# Altium schematic sheet JTAG&Trace.SchDoc
size A4; Revision: C.2
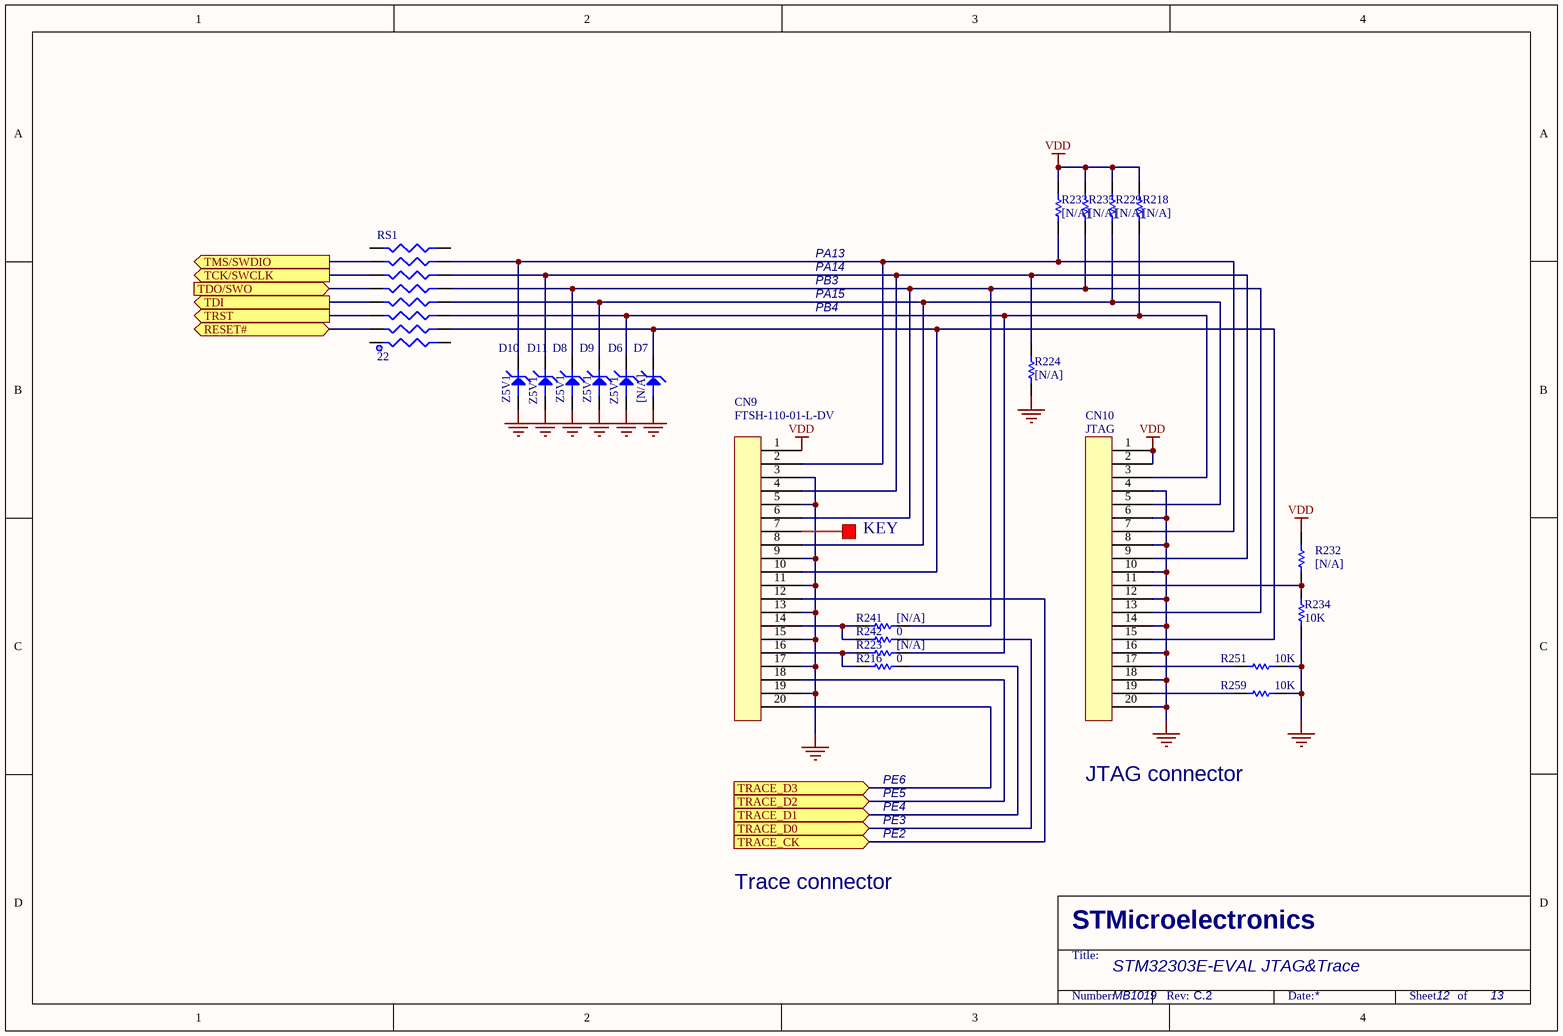
[diagram p0: JTAG&Trace.SchDoc]

## Parts
CN9  FTSH-110-01-L-DV  [FTSH-110-01-L-DV]
CN10  JTAG  [IDC20S]
D6  Z5V1  [SOT-23]
D7  [N/A]  [SOT-23]
D8  Z5V1  [SOT-23]
D9  Z5V1  [SOT-23]
D10  Z5V1  [SOT-23]
D11  Z5V1  [SOT-23]
R216  0  [0603R]
R218  [N/A]  [0603R]
R223  [N/A]  [0603R]
R224  [N/A]  [0603R]
R229  [N/A]  [0603R]
R232  [N/A]  [0603R]
R233  [N/A]  [0603R]
R234  10K  [0603R]
R235  [N/A]  [0603R]
R241  [N/A]  [0603R]
R242  0  [0603R]
R251  10K  [0603R]
R259  10K  [0603R]
RS1  22  [RES8B_0402]

## Ports
RESET# (bidir), TCK/SWCLK (out), TDI (out), TDO/SWO (in), TMS/SWDIO (out), TRACE_CK (in), TRACE_D0 (in), TRACE_D1 (in), TRACE_D2 (in), TRACE_D3 (in), TRST (out)

## Nets
GND: CN9.3 CN9.5 CN9.9 CN9.11 CN9.13 CN9.15 CN9.17 CN9.19 CN10.4 CN10.6 CN10.8 CN10.10 CN10.12 CN10.14 CN10.16 CN10.18 CN10.20 D6.2 D7.2 D8.2 D9.2 D10.2 D11.2 R224.1 R234.1 R251.1 R259.1
VDD: CN9.1 CN10.1 CN10.2 R218.2 R229.2 R232.2 R233.2 R235.2
RESET#: RS1.3 ; port RESET#
TCK/SWCLK: RS1.11 ; port TCK/SWCLK
TDI: RS1.7 ; port TDI
TDO/SWO: RS1.9 ; port TDO/SWO
TMS/SWDIO: RS1.13 ; port TMS/SWDIO
TRACE_CK: CN9.12 ; port TRACE_CK
TRACE_D0: R242.2 ; port TRACE_D0
TRACE_D1: R216.2 ; port TRACE_D1
TRACE_D2: CN9.18 ; port TRACE_D2
TRACE_D3: CN9.20 ; port TRACE_D3
TRST: RS1.5 ; port TRST
NetCN9_2: CN9.2 CN10.7 D10.3 R233.1 RS1.14
NetCN9_4: CN9.4 CN10.9 D11.3 R224.2 RS1.12
NetCN9_6: CN9.6 CN10.13 D8.3 R235.1 R241.2 RS1.10
NetCN9_8: CN9.8 CN10.5 D9.3 R229.1 RS1.8
NetCN9_10: CN9.10 CN10.15 D7.3 RS1.4
NetCN9_14: CN9.14 R241.1 R242.1
NetCN9_16: CN9.16 R216.1 R223.1
NetCN10_3: CN10.3 D6.3 R218.1 R223.2 RS1.6
NetCN10_11: CN10.11 R232.1 R234.2
NetCN10_17: CN10.17 R251.2
NetCN10_19: CN10.19 R259.2

Not connected (* = marked no-connect by the designer): CN9 7; RS1 1 2 15 16

## Notes on the sheet
- PA13
- PA14
- PB3
- PA15
- PB4
- KEY
- PE6
- JTAG connector
- PE5
- PE4
- PE3
- PE2
- Trace connector
- STM32303E-EVAL JTAG&Trace
- MB1019
- 12
- 13
- STMicroelectronics
- Title:
- Number:
- Rev:
- Date:
- Sheet       of

## Library data of the parts
CN9 CN10 = 20PIN1
D6-D11 = BATS5V6
R216 R218 R223 R224 R229 R232-R235 R241 R242 R251 R259 = Res1: Resistor; Value: 1K; Published: 8-Jun-2000; Revision: July-2002: Re-released for DXP Platform.; Publisher: Altium Limited
RS1 = RES8B